# EAGLE schematic wiring-harness-complete-v1.0 (EAGLE 7.2.0)
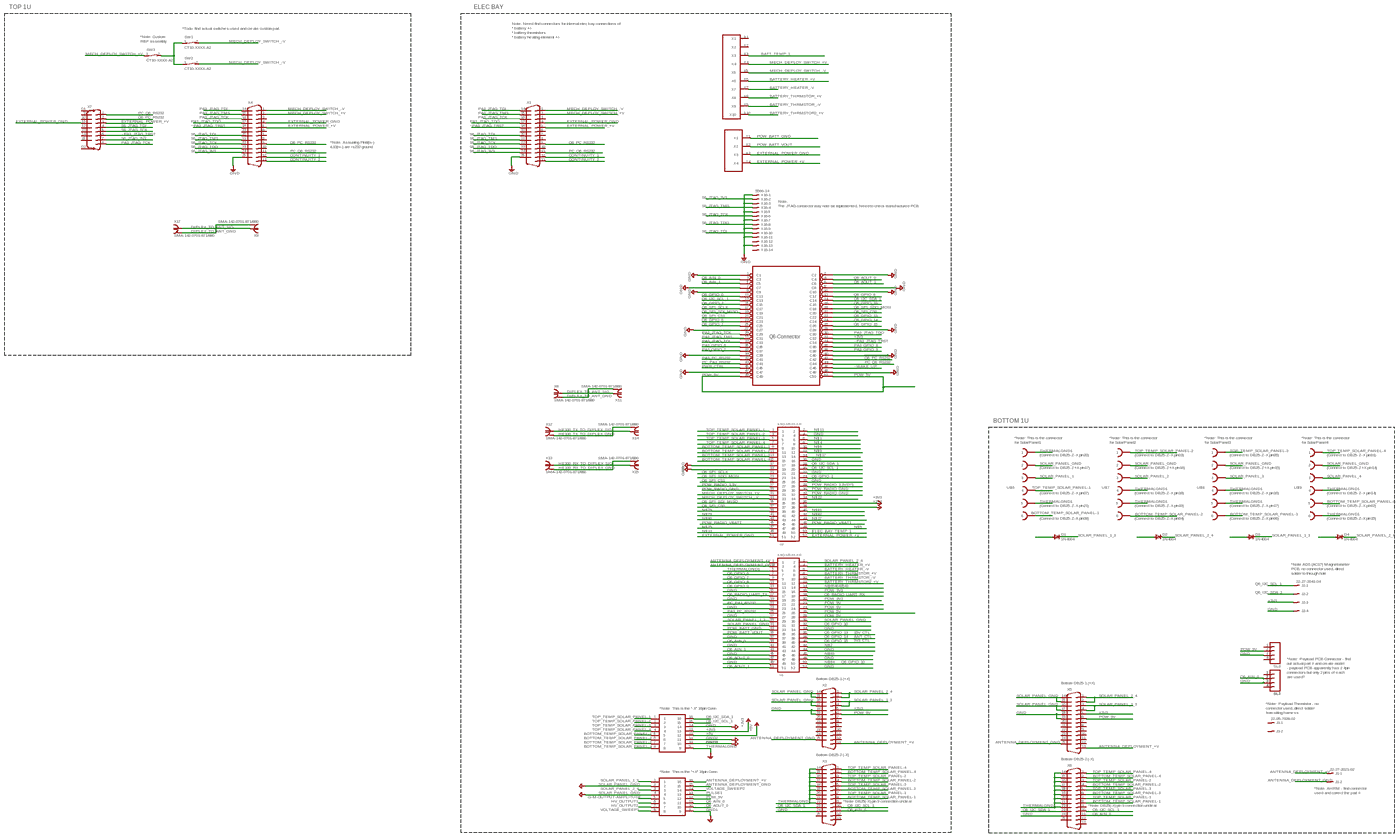
[diagram p0: schematic, sheet 1, overview]
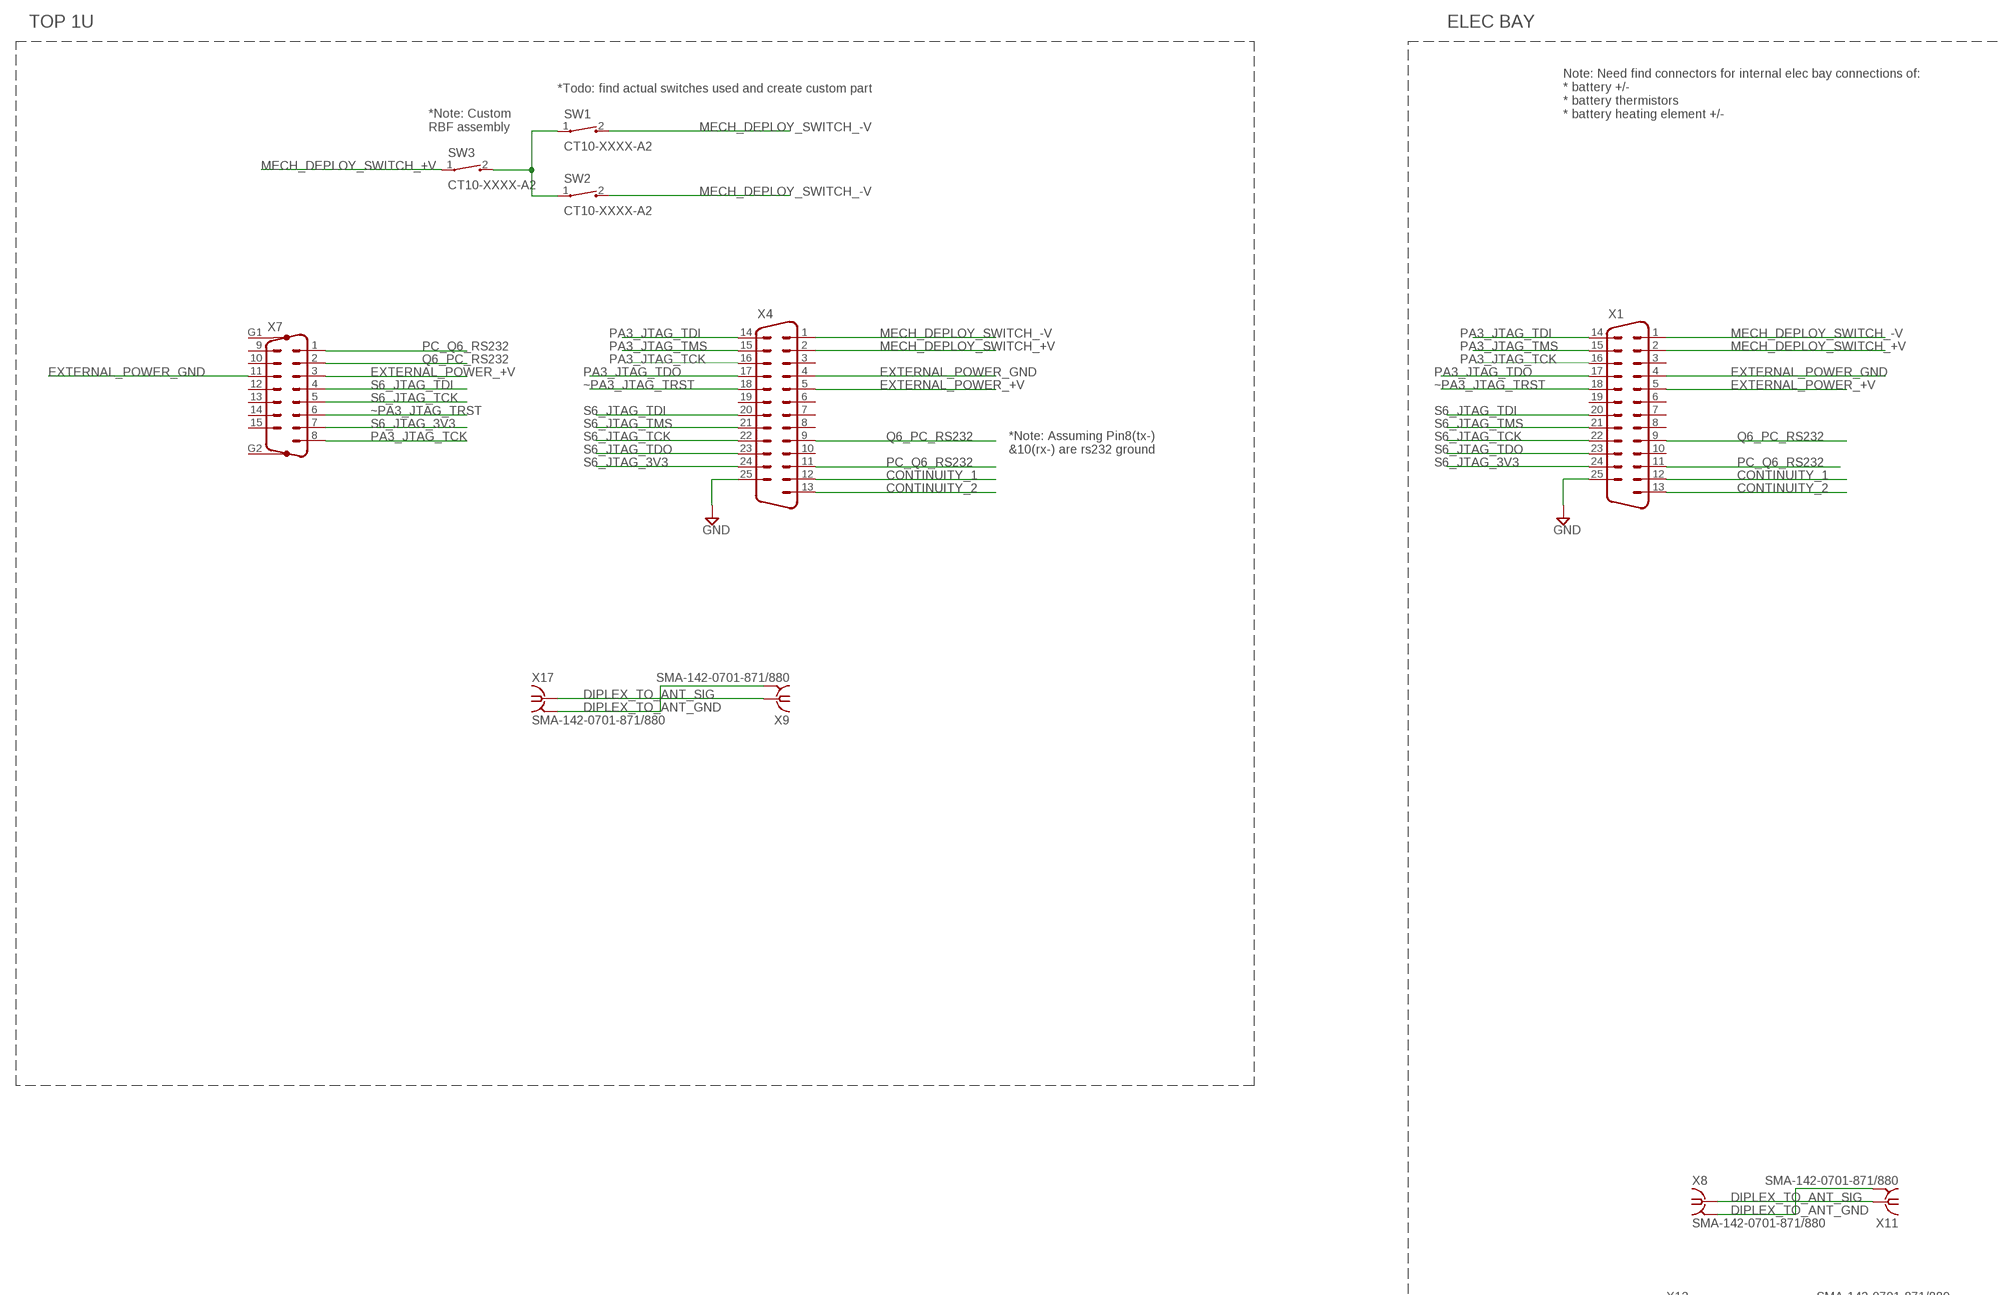
[diagram p1: schematic, sheet 1, part 1 of 4]
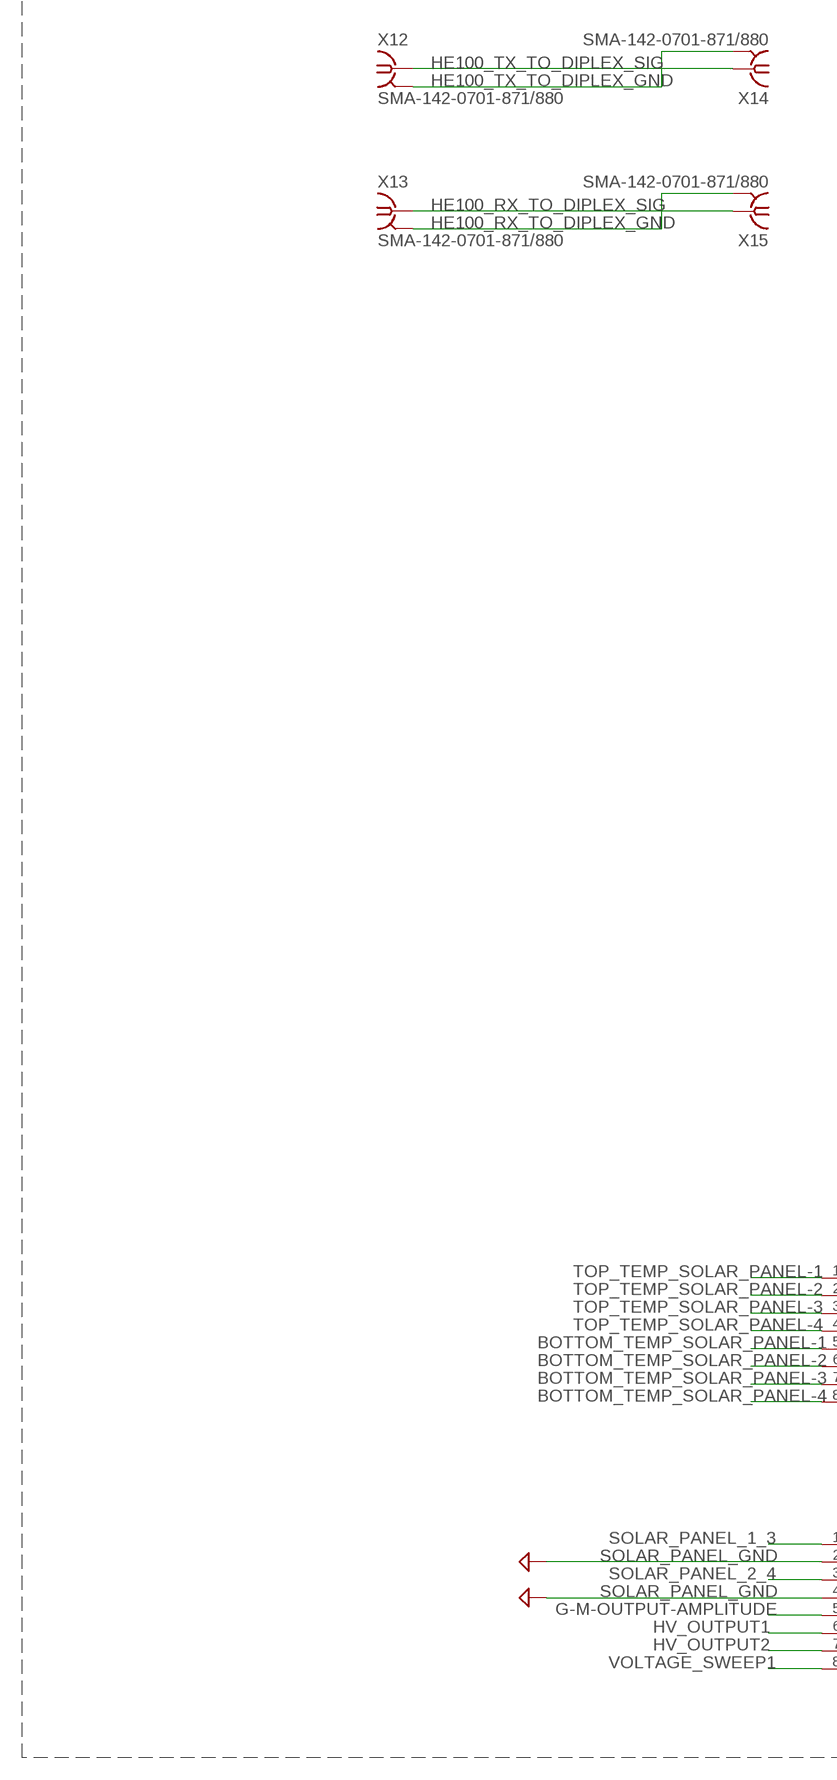
[diagram p2: schematic, sheet 1, part 2 of 4]
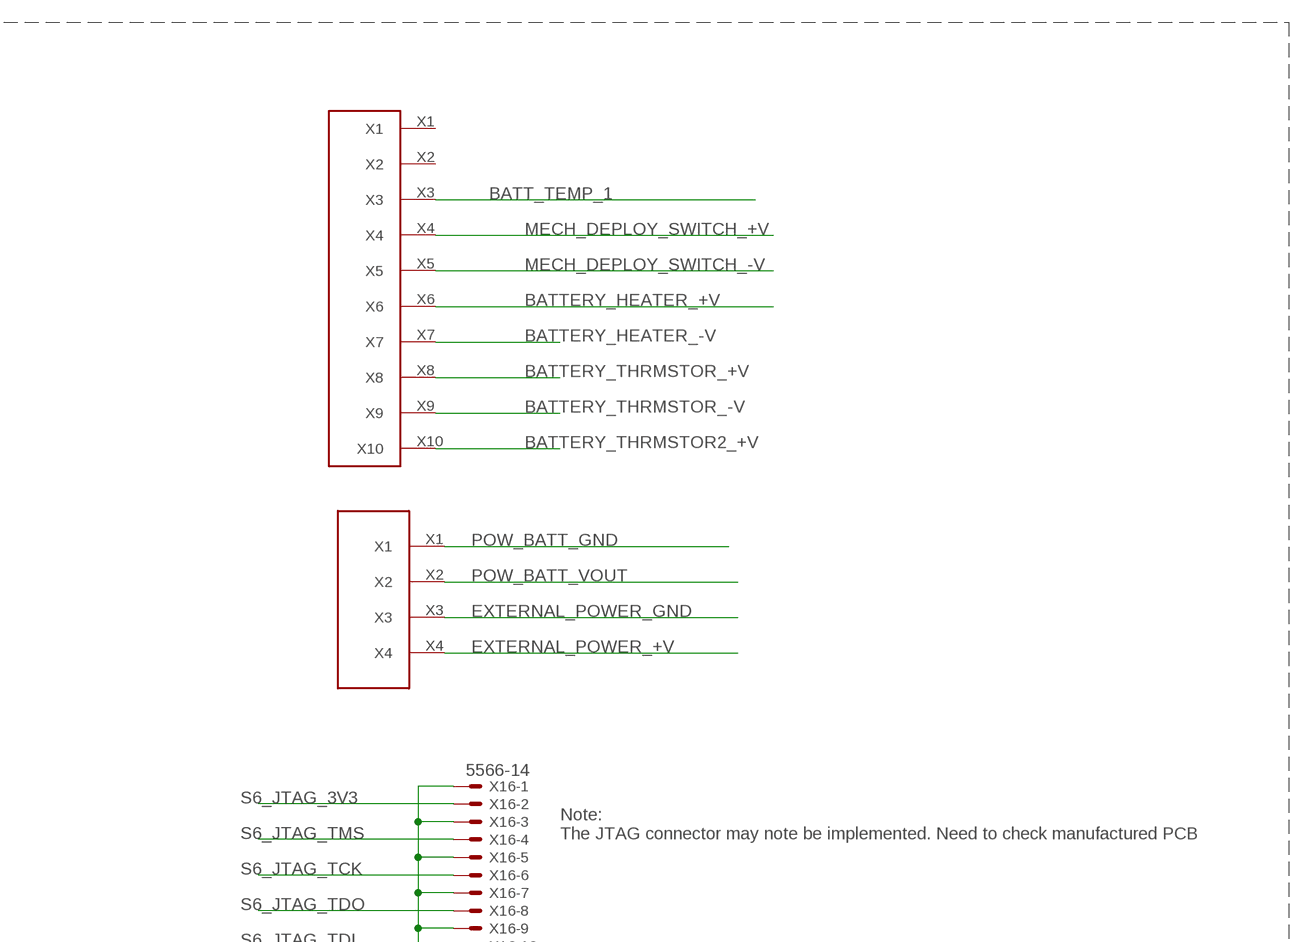
[diagram p3: schematic, sheet 1, part 3 of 4]
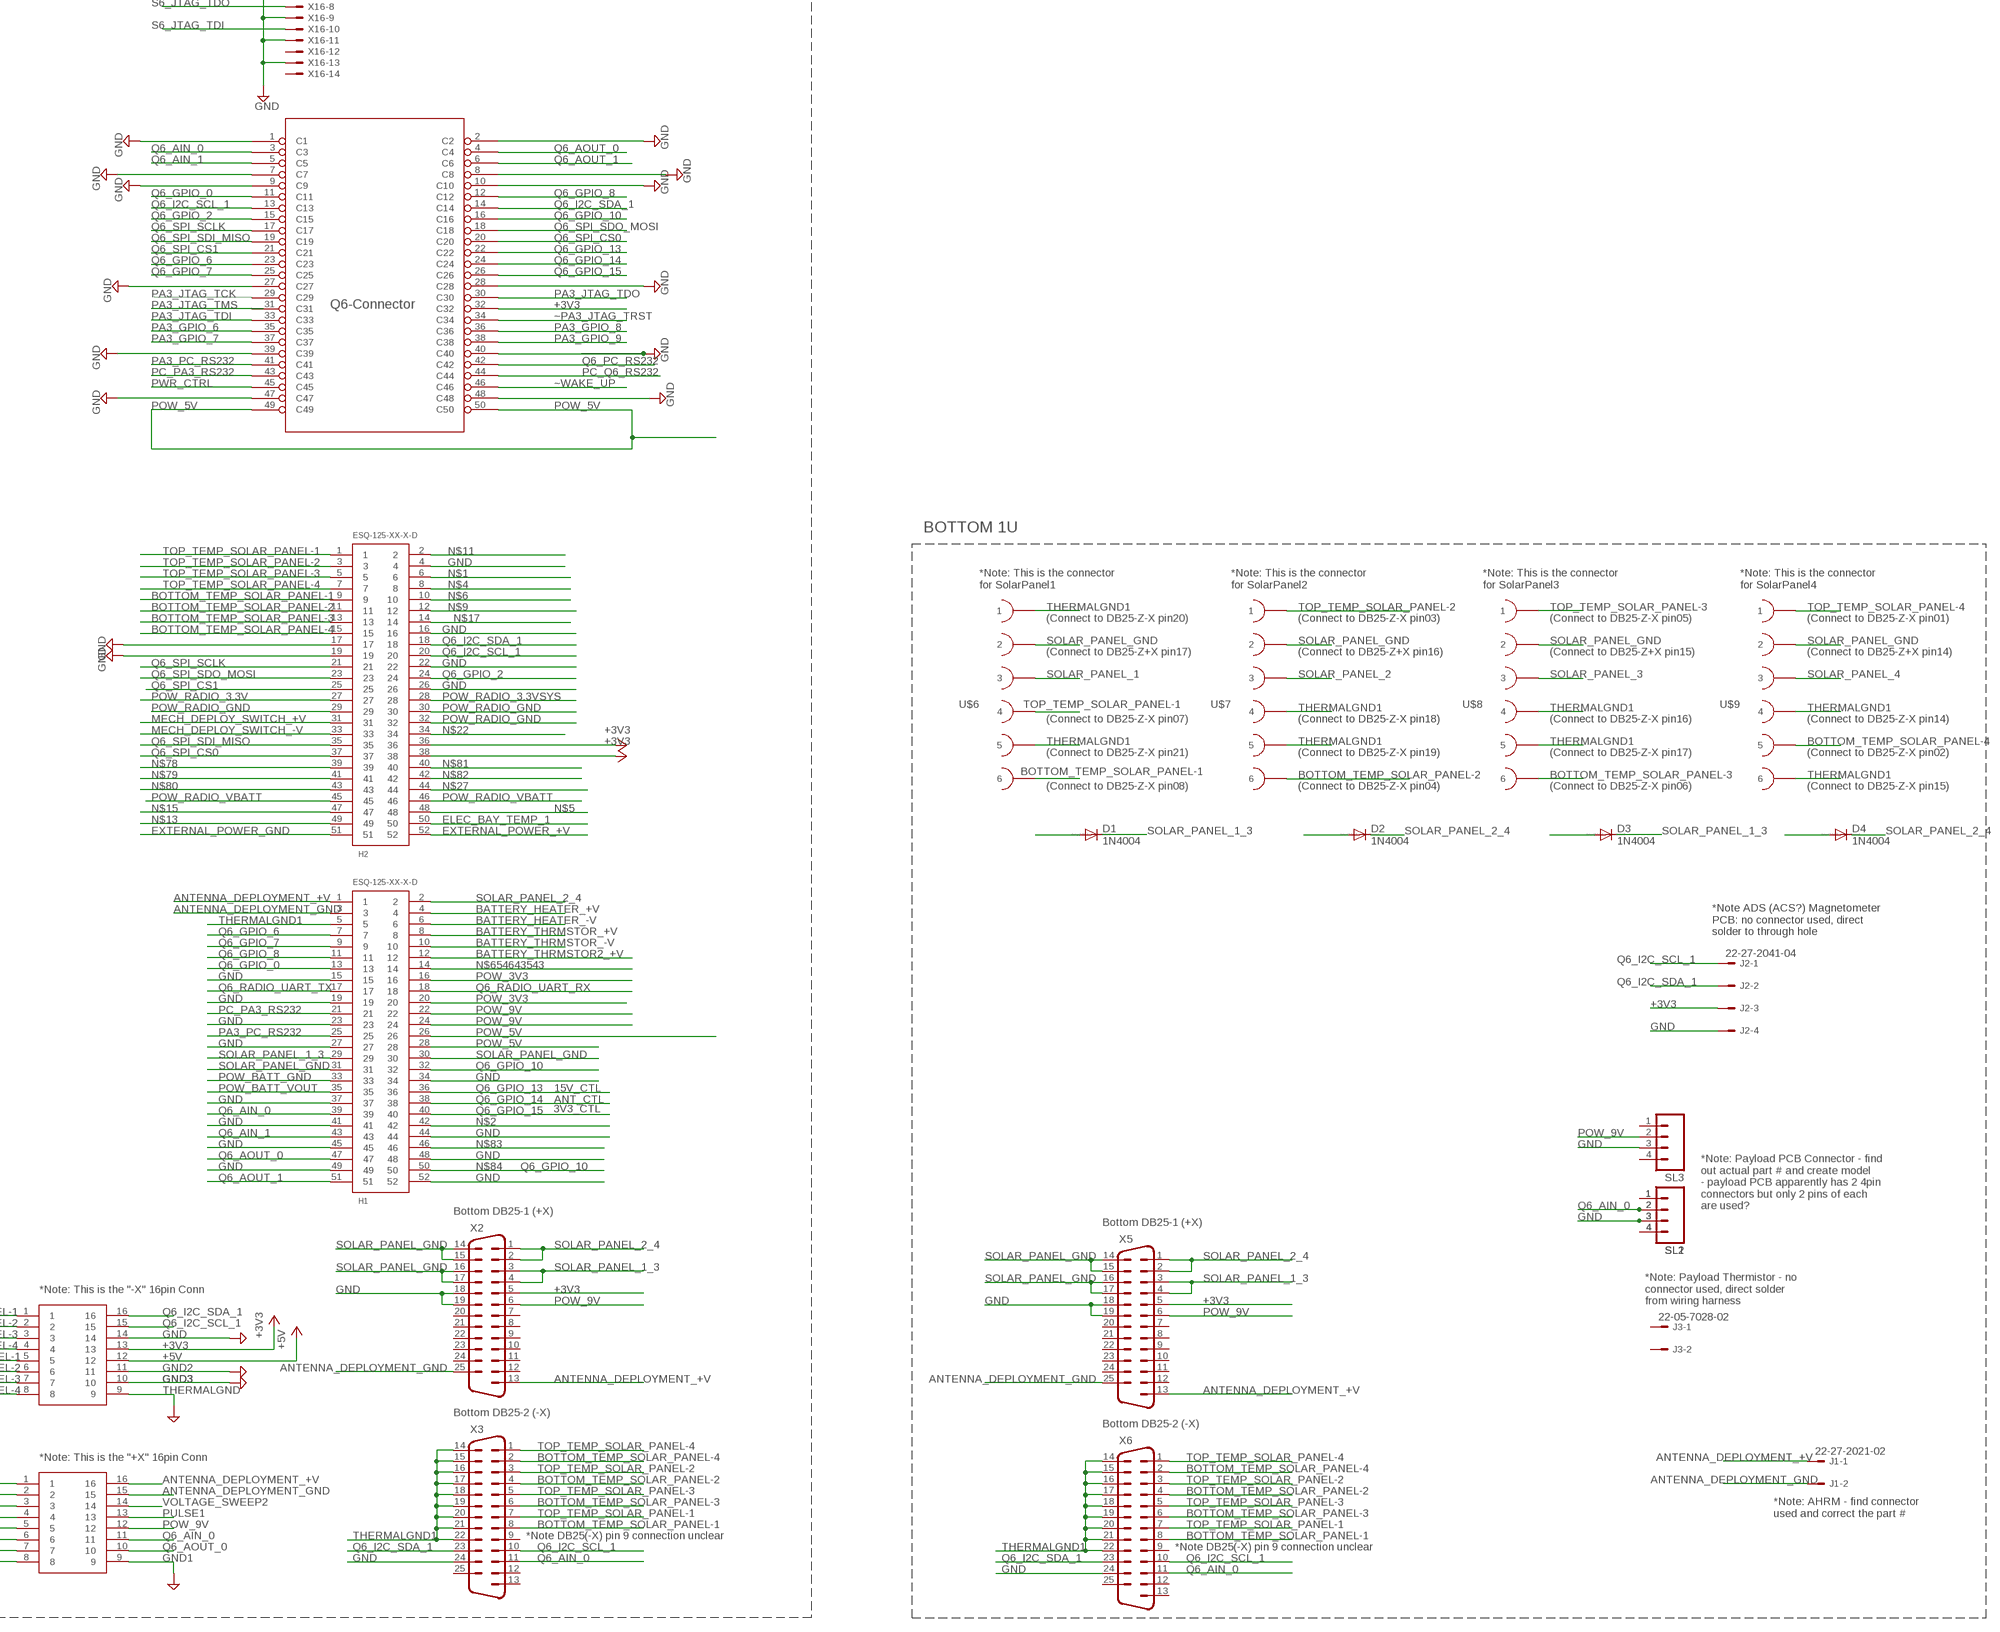
[diagram p4: schematic, sheet 1, part 4 of 4]

## Parts
D1  1N4004  [DO41-10]
D2  1N4004  [DO41-10]
D3  1N4004  [DO41-10]
D4  1N4004  [DO41-10]
H1  ESQ-125-XX-X-D  [ESQ-125-XX-X-D]
H2  ESQ-125-XX-X-D  [ESQ-125-XX-X-D]
J1  22-27-2021-02  [6410-02]
J2  22-27-2041-04  [6410-04]
J3  22-05-7028-02  [7395-02]
SL1  MA04  [04PA]
SL2  MA04  [04PA]
SL3  MA04  [04PA]
SW1  CT10-XXXX-A2  [CT10-XXXX-A2]
SW2  CT10-XXXX-A2  [CT10-XXXX-A2]
SW3  CT10-XXXX-A2  [CT10-XXXX-A2]
U$1  SMFC  [SFMC-107-01-XX-D]
U$2  M80-5000000M1-10-331-000  [M80-5000000M1]
U$3  M80-5000000M1-10-331-00-000  [M80-5000000M1-04-331-00-000]
U$4  M80-866XXXX  [M80-866XXXX]
U$5  M80-866XXXX  [M80-866XXXX]
U$6  GLENAIR-171-006-6-S-6-7-18  [GLENAIR-171-006-6-P-.150-BL]
U$7  GLENAIR-171-006-6-S-6-7-18  [GLENAIR-171-006-6-P-.150-BL]
U$8  GLENAIR-171-006-6-S-6-7-18  [GLENAIR-171-006-6-P-.150-BL]
U$9  GLENAIR-171-006-6-S-6-7-18  [GLENAIR-171-006-6-P-.150-BL]
X1  M25VP  [M25VP]
X2  M25VP  [M25VP]
X3  M25VP  [M25VP]
X4  M25VP  [M25VP]
X5  M25VP  [M25VP]
X6  M25VP  [M25VP]
X7  M15VP  [M15VP]
X8  SMA-142-0701-871/880  [SMA-142-0701-871]
X9  SMA-142-0701-871/880  [SMA-142-0701-871]
X11  SMA-142-0701-871/880  [SMA-142-0701-871]
X12  SMA-142-0701-871/880  [SMA-142-0701-871]
X13  SMA-142-0701-871/880  [SMA-142-0701-871]
X14  SMA-142-0701-871/880  [SMA-142-0701-871]
X15  SMA-142-0701-871/880  [SMA-142-0701-871]
X16  5566-14  [5566-14]
X17  SMA-142-0701-871/880  [SMA-142-0701-871]

## Nets
+3V3: H2.36 H2.38 U$1.32(C32) U$5.13 X2.5 X5.5
+5V: U$5.12
ANTENNA_DEPLOYMENT_+V: H1.1 U$4.16 X2.13 X5.13
ANTENNA_DEPLOYMENT_GND: H1.3 U$4.15 X2.25 X5.25
BATT_TEMP_1: U$2.X3
BATTERY_HEATER_+V: H1.4 U$2.X6
BATTERY_HEATER_-V: H1.6 U$2.X7
BATTERY_THRMSTOR2_+V: H1.12 U$2.X10
BATTERY_THRMSTOR_+V: H1.8 U$2.X8
BATTERY_THRMSTOR_-V: H1.10 U$2.X9
BOTTOM_TEMP_SOLAR_PANEL-1: H2.9 U$5.5 X3.8 X6.8
BOTTOM_TEMP_SOLAR_PANEL-2: H2.11 U$5.6 X3.4 X6.4
BOTTOM_TEMP_SOLAR_PANEL-3: H2.13 U$5.7 X3.6 X6.6
BOTTOM_TEMP_SOLAR_PANEL-4: H2.15 U$5.8 X3.2 X6.2
CONTINUITY_1: X4.12
CONTINUITY_2: X4.13
DIPLEX_TO_ANT_GND: X8.2@1 X8.2@2 X8.2@3 X8.2@4 X9.2@1 X9.2@2 X9.2@3 X9.2@4 X11.2@1 X11.2@2 X11.2@3 X11.2@4 X17.2@1 X17.2@2 X17.2@3 X17.2@4
DIPLEX_TO_ANT_SIG: X8.1 X9.1 X11.1 X17.1
ELEC_BAY_TEMP_1: H2.50
EXTERNAL_POWER_+V: H2.52 U$3.X4 X1.5 X4.5
EXTERNAL_POWER_GND: H2.51 U$3.X3 X1.4 X4.4
G-M-OUTPUT-AMPLITUDE: U$4.5
GND: H1.15 H1.19 H1.23 H1.27 H1.34 H1.37 H1.41 H1.44 H1.45 H1.48 H1.49 H1.52 H2.4 H2.16 H2.17 H2.19 H2.22 H2.26 SL1.3 SL2.3 SL3.3 U$1.1(C1) U$1.2(C2) U$1.7(C7) U$1.8(C8) U$1.9(C9) U$1.10(C10) U$1.27(C27) U$1.28(C28) U$1.39(C39) U$1.40(C40) U$1.47(C47) U$1.48(C48) U$4.2 U$4.4 U$4.9 U$5.9 U$5.10 U$5.11 U$5.14 X1.25 X2.18 X2.19 X3.24 X4.25 X5.18 X5.19 X6.24 X16.1 X16.3 X16.5 X16.7 X16.9 X16.11 X16.13
HE100_RX_TO_DIPLEX_GND: X13.2@1 X13.2@2 X13.2@3 X13.2@4 X15.2@1 X15.2@2 X15.2@3 X15.2@4
HE100_RX_TO_DIPLEX_SIG: X13.1 X15.1
HE100_TX_TO_DIPLEX_GND: X12.2@1 X12.2@2 X12.2@3 X12.2@4 X14.2@1 X14.2@2 X14.2@3 X14.2@4
HE100_TX_TO_DIPLEX_SIG: X12.1 X14.1
HV_OUTPUT1: U$4.6
HV_OUTPUT2: U$4.7
MECH_DEPLOY_SWITCH_+V: H2.31 U$2.X4 X1.2 X4.2
MECH_DEPLOY_SWITCH_-V: H2.33 U$2.X5 X1.1 X4.1
N$1: H2.6
N$2: H1.42
N$3: SW1.1 SW2.1 SW3.2
N$4: H2.8
N$5: H2.48
N$6: H2.10
N$7: SL1.1 SL2.1
N$8: SL1.4 SL2.4
N$9: H2.12
N$11: H2.2
N$13: H2.49
N$15: H2.47
N$17: H2.14
N$22: H2.34
N$27: H2.44
N$78: H2.39
N$79: H2.41
N$80: H2.43
N$81: H2.40
N$82: H2.42
N$83: H1.46
N$84: H1.50
N$654643543: H1.14
PA3_GPIO_6: U$1.35(C35)
PA3_GPIO_7: U$1.37(C37)
PA3_GPIO_8: U$1.36(C36)
PA3_GPIO_9: U$1.38(C38)
PA3_JTAG_TCK: U$1.29(C29) X1.16 X4.16 X7.8
PA3_JTAG_TDI: U$1.33(C33) X1.14 X4.14
PA3_JTAG_TDO: U$1.30(C30) X1.17 X4.17
PA3_JTAG_TMS: U$1.31(C31) X1.15 X4.15
PA3_PC_RS232: H1.25 U$1.41(C41)
PC_PA3_RS232: H1.21 U$1.43(C43)
PC_Q6_RS232: U$1.44(C44)
POW_3V3: H1.16 H1.20
POW_5V: H1.26 H1.28 U$1.49(C49) U$1.50(C50)
POW_9V: H1.22 H1.24 SL3.2 U$4.12 X2.6 X5.6
POW_BATT_GND: H1.33 U$3.X1
POW_BATT_VOUT: H1.35 U$3.X2
POW_RADIO_3.3V: H2.27
POW_RADIO_3.3VSYS: H2.28
POW_RADIO_GND: H2.29 H2.30 H2.32
POW_RADIO_VBATT: H2.45 H2.46
PULSE1: U$4.13
PWR_CTRL: U$1.45(C45)
Q6_AIN_0: H1.39 SL1.2 SL2.2 U$1.3(C3) U$4.11 X3.11 X6.11
Q6_AIN_1: H1.43 U$1.5(C5)
Q6_AOUT_0: H1.47 U$4.10
Q6_AOUT_1: H1.51
Q6_AOUT_2: U$1.4(C4)
Q6_AOUT_3: U$1.6(C6)
Q6_GPIO_0: H1.13 U$1.11(C11)
Q6_GPIO_2: H2.24 U$1.15(C15)
Q6_GPIO_6: H1.7 U$1.23(C23)
Q6_GPIO_7: H1.9 U$1.25(C25)
Q6_GPIO_8: H1.11 U$1.12(C12)
Q6_GPIO_10: H1.32 U$1.16(C16)
Q6_GPIO_13: H1.36 U$1.22(C22)
Q6_GPIO_14: H1.38 U$1.24(C24)
Q6_GPIO_15: H1.40 U$1.26(C26)
Q6_I2C_SCL_1: H2.20 U$1.13(C13) U$5.15 X3.10 X6.10
Q6_I2C_SDA_1: H2.18 U$1.14(C14) U$5.16 X3.23 X6.23
Q6_PC_RS232: U$1.42(C42)
Q6_RADIO_UART_RX: H1.18
Q6_RADIO_UART_TX: H1.17
Q6_SPI_CS0: H2.37 U$1.20(C20)
Q6_SPI_CS1: H2.25 U$1.21(C21)
Q6_SPI_SCLK: H2.21 U$1.17(C17)
Q6_SPI_SDI_MISO: H2.35 U$1.19(C19)
Q6_SPI_SDO_MOSI: H2.23 U$1.18(C18)
S6_JTAG_3V3: X1.24 X4.24 X16.2
S6_JTAG_TCK: X1.22 X4.22 X16.6
S6_JTAG_TDI: X1.20 X4.20 X16.10
S6_JTAG_TDO: X1.23 X4.23 X16.8
S6_JTAG_TMS: X1.21 X4.21 X16.4
SOLAR_PANEL_1: U$6.P$3
SOLAR_PANEL_1_3: H1.29 U$4.1 X2.3 X2.4 X5.3 X5.4
SOLAR_PANEL_2: U$7.P$3
SOLAR_PANEL_2_4: H1.2 U$4.3 X2.1 X2.2 X5.1 X5.2
SOLAR_PANEL_3: U$8.P$3
SOLAR_PANEL_4: U$9.P$3
SOLAR_PANEL_GND: H1.30 H1.31 U$8.P$2 X2.14 X2.15 X2.16 X2.17 X5.14 X5.15 X5.16 X5.17
THERMALGND1: H1.5 U$8.P$5 X3.14 X3.15 X3.16 X3.17 X3.18 X3.19 X3.20 X3.21 X3.22 X6.14 X6.15 X6.16 X6.17 X6.18 X6.19 X6.20 X6.21 X6.22
TOP_TEMP_SOLAR_PANEL-1: H2.1 U$5.1 U$6.P$4 X3.7 X6.7
TOP_TEMP_SOLAR_PANEL-2: H2.3 U$5.2 X3.3 X6.3
TOP_TEMP_SOLAR_PANEL-3: H2.5 U$5.3 X3.5 X6.5
TOP_TEMP_SOLAR_PANEL-4: H2.7 U$5.4 X3.1 X6.1
VOLTAGE_SWEEP1: U$4.8
VOLTAGE_SWEEP2: U$4.14
~PA3_JTAG_TRST: U$1.34(C34) X1.18 X4.18
~WAKE_UP: U$1.46(C46)
Unconnected: D1.A D1.C D2.A D2.C D3.A D3.C D4.A D4.C J1.1 J1.2 J2.1 J2.2 J2.3 J2.4 J3.1 J3.2 SL3.1 SL3.4 SW1.2 SW2.2 SW3.1 U$2.X1 U$2.X2 U$6.P$1 U$6.P$2 U$6.P$5 U$6.P$6 U$7.P$1 U$7.P$2 U$7.P$4 U$7.P$5 U$7.P$6 U$8.P$1 U$8.P$4 U$8.P$6 U$9.P$1 U$9.P$2 U$9.P$4 U$9.P$5 U$9.P$6 X1.3 X1.6 X1.7 X1.8 X1.9 X1.10 X1.11 X1.12 X1.13 X1.19 X2.7 X2.8 X2.9 X2.10 X2.11 X2.12 X2.20 X2.21 X2.22 X2.23 X2.24 X3.9 X3.12 X3.13 X3.25 X4.3 X4.6 X4.7 X4.8 X4.9 X4.10 X4.11 X4.19 X5.7 X5.8 X5.9 X5.10 X5.11 X5.12 X5.20 X5.21 X5.22 X5.23 X5.24 X6.9 X6.12 X6.13 X6.25 X7.1 X7.2 X7.3 X7.4 X7.5 X7.6 X7.7 X7.9 X7.10 X7.11 X7.12 X7.13 X7.14 X7.15 X7.G1 X7.G2 X16.12 X16.14

## Notes on the sheet
- TOP 1U | ELEC BAY
- *Todo: find actual switches used and create custom part
- Note: Need find connectors for internal elec bay connections of:
  * battery +/-
  * battery thermistors
  * battery heating element +/-
- *Note: Custom
  RBF assembly
- *Note: Assuming Pin8(tx-)
  &10(rx-) are rs232 ground
- Note:
  The JTAG connector may note be implemented. Need to check manufactured PCB
- Q6_AOUT_0
- Q6_AOUT_1
- Q6-Connector
- BOTTOM 1U
- *Note: This is the connector
  for SolarPanel1
- *Note: This is the connector
  for SolarPanel2
- *Note: This is the connector
  for SolarPanel3
- *Note: This is the connector
  for SolarPanel4
- (Connect to DB25-Z-X pin20) | (Connect to DB25-Z-X pin03) | (Connect to DB25-Z-X pin05) | (Connect to DB25-Z-X pin01)
- (Connect to DB25-Z+X pin17) | (Connect to DB25-Z+X pin16) | (Connect to DB25-Z+X pin15) | (Connect to DB25-Z+X pin14)
- (Connect to DB25-Z-X pin07) | (Connect to DB25-Z-X pin18) | (Connect to DB25-Z-X pin16) | (Connect to DB25-Z-X pin14)
- (Connect to DB25-Z-X pin21) | (Connect to DB25-Z-X pin19) | (Connect to DB25-Z-X pin17) | (Connect to DB25-Z-X pin02)
- (Connect to DB25-Z-X pin08) | (Connect to DB25-Z-X pin04) | (Connect to DB25-Z-X pin06) | (Connect to DB25-Z-X pin15)
- SOLAR_PANEL_2_4
- *Note ADS (ACS?) Magnetometer
  PCB: no connector used, direct 
  solder to through hole
- 15V_CTL
- ANT_CTL
- 3V3_CTL
- Q6_GPIO_10
- *Note: Payload PCB Connector - find
  out actual part # and create model
  - payload PCB apparently has 2 4pin
  connectors but only 2 pins of each 
  are used?
- Bottom DB25-1 (+X)
- Bottom DB25-1 (+X)
- *Note: This is the "-X" 16pin Conn
- *Note: Payload Thermistor - no 
  connector used, direct solder 
  from wiring harness
- GND2
- GND3 | GND3
- THERMALGND
- Bottom DB25-2 (-X)
- Bottom DB25-2 (-X)
- *Note: This is the "+X" 16pin Conn
- SOLAR_PANEL_GND
- SOLAR_PANEL_GND
- *Note: AHRM - find connector
  used and correct the part #
- *Note DB25(-X) pin 9 connection unclear
- *Note DB25(-X) pin 9 connection unclear
- GND1

## Library data of the parts
D1-D4 = diode:1N4004: DIODE general purpose rectifier, 1 A
H1 H2 = ESQ-126-XX-X-D:ESQ-125-XX-X-D: ELEVATED SOCKET, .100 inch(2.54mm) PITCH
J1 = con-molex:22-?-02: CONNECTOR wire to board 2.54 mm (.1 inch) pitch header; OC_FARNELL: unknown; OC_NEWARK: unknown
J2 = con-molex:22-?-04: CONNECTOR wire to board 2.54 mm (.1 inch) pitch header; OC_FARNELL: unknown; OC_NEWARK: unknown
J3 = con-molex:22-?-02: CONNECTOR wire to board 2.54 mm (.1 inch) pitch header; OC_FARNELL: 9731601; OC_NEWARK: unknown
SL1-SL3 = con-amp-quick:MA04: AMP QUICK CONNECTOR; OC_FARNELL: unknown; OC_NEWARK: unknown
SW1-SW3 = switch-coto:CT10-XXXX-: CT10 Series Molded Switch Source: www.cotorelay.com .. Coto_Technology__CT10-1530-G1.pdf
U$1 = SFMC-125-02-S-D:SMFC
U$2 = harwin:M80-5000000M1-10-331-000
U$3 = harwin:M80-5000000M1-10-331-00-000
U$4 U$5 = harwin:M80-866XXXX
U$6-U$9 = space-concordia-power:GLENAIR-171-006-6-S-6-7-18: GLENAIR-171-006 Series 6 pin sil connector space rated(need reference)
X1-X6 = con-subd:M25: SUB-D; OC_FARNELL: unknown; OC_NEWARK: unknown
X7 = con-subd:M15VP: SUB-D; OC_FARNELL: unknown; OC_NEWARK: unknown
X8 X9 X11-X15 X17 = con-coax:SMA-: SMA 50 Ohm End Launch Jack Receptacle - Round Contact Johnson Components Source: www.johnsoncomponents.com .. J502-ND.pdf; MF: JOHNSON COMPONENTS; MPN: 142-0701-871; OC_FARNELL: 1339835; OC_NEWARK: 91B6105
X16 = con-molex:5566-14: Mini FIT connector 14 pol Source: http://www.molex.com; OC_FARNELL: unknown; OC_NEWARK: unknown

## Net classes
0 default: width 0.406 mm